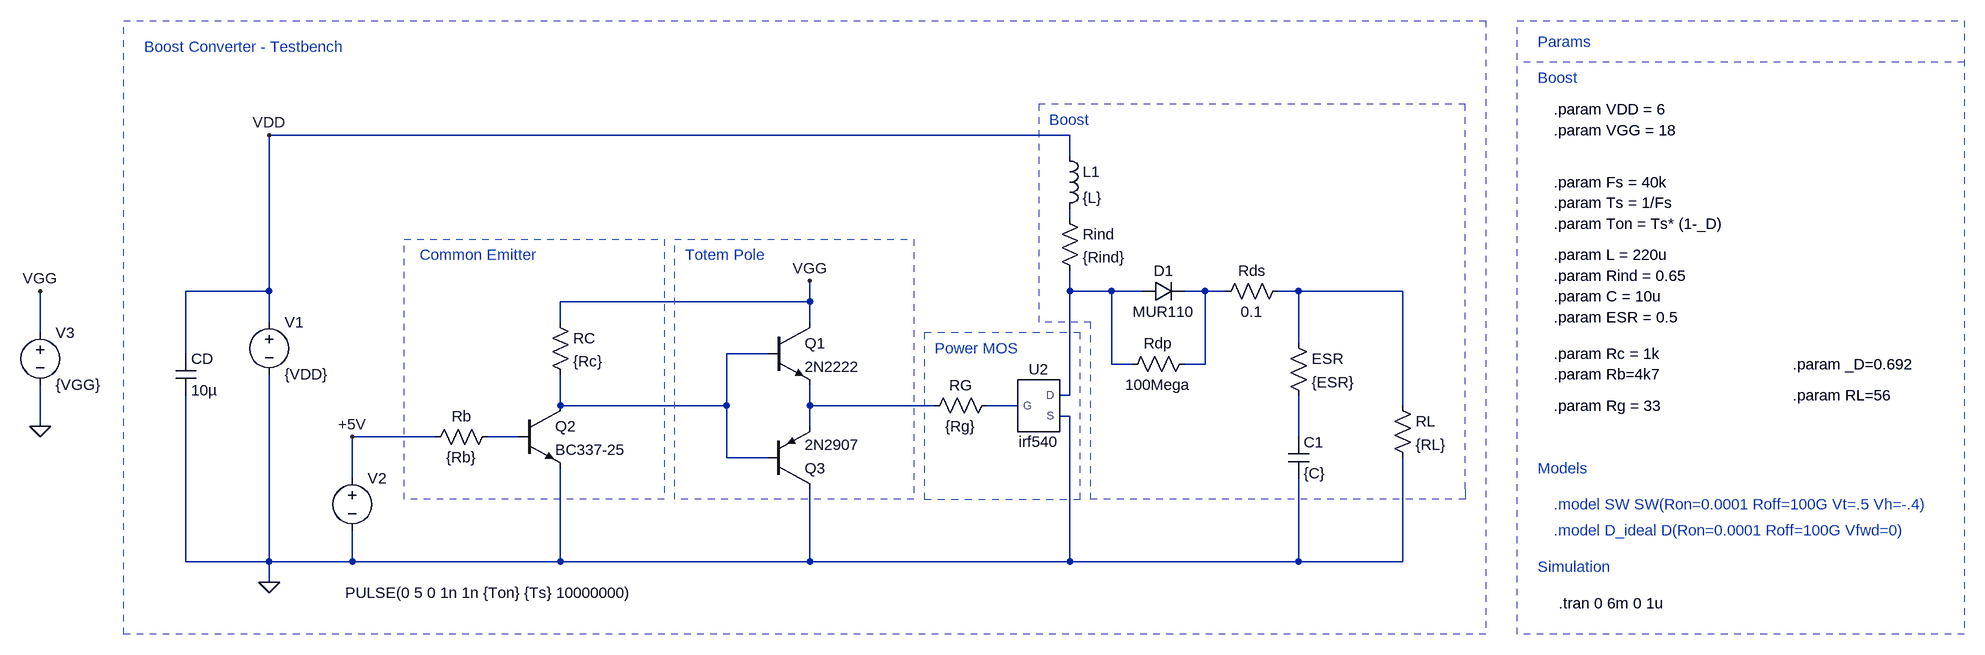
[diagram p0: schematic Boost_Completo.asc]
Boost_Completo.asc, the LTspice schematic file:
Version 4
SHEET 1 1252 680
WIRE -128 -224 -1360 -224
WIRE -128 -192 -128 -224
WIRE -128 -96 -128 -112
WIRE -1360 16 -1360 -224
WIRE -1360 16 -1488 16
WIRE -128 16 -128 -16
WIRE -64 16 -128 16
WIRE -16 16 -64 16
WIRE 80 16 48 16
WIRE 112 16 80 16
WIRE 224 16 192 16
WIRE 384 16 224 16
WIRE -528 32 -528 0
WIRE -528 32 -912 32
WIRE -1360 64 -1360 16
WIRE -912 64 -912 32
WIRE -528 64 -528 32
WIRE -1712 80 -1712 16
WIRE 224 96 224 16
WIRE -1488 112 -1488 16
WIRE -592 112 -656 112
WIRE -64 128 -64 16
WIRE -32 128 -64 128
WIRE 80 128 80 16
WIRE 80 128 48 128
WIRE -128 176 -128 16
WIRE -128 176 -144 176
WIRE -912 192 -912 144
WIRE -656 192 -656 112
WIRE -656 192 -912 192
WIRE -528 192 -528 160
WIRE -336 192 -528 192
WIRE -208 192 -256 192
WIRE 384 192 384 16
WIRE -128 208 -144 208
WIRE -1712 224 -1712 160
WIRE -528 224 -528 192
WIRE -1104 240 -1232 240
WIRE -976 240 -1024 240
WIRE 224 240 224 176
WIRE -656 272 -656 192
WIRE -592 272 -656 272
WIRE -1232 304 -1232 240
WIRE -1488 432 -1488 176
WIRE -1360 432 -1360 144
WIRE -1360 432 -1488 432
WIRE -1232 432 -1232 384
WIRE -1232 432 -1360 432
WIRE -912 432 -912 288
WIRE -912 432 -1232 432
WIRE -528 432 -528 320
WIRE -528 432 -912 432
WIRE -128 432 -128 208
WIRE -128 432 -528 432
WIRE 224 432 224 304
WIRE 224 432 -128 432
WIRE 384 432 384 272
WIRE 384 432 224 432
WIRE -1360 464 -1360 432
FLAG -1360 464 0
FLAG -1360 -224 VDD
FLAG -1232 240 +5V
FLAG -1712 224 0
FLAG -1712 16 VGG
FLAG -528 0 VGG
DATAFLAG 336 432 ""
DATAFLAG -704 192 ""
DATAFLAG -496 192 ""
SYMBOL diode -16 32 R270
WINDOW 0 32 32 VTop 2
WINDOW 3 0 32 VBottom 2
SYMATTR InstName D1
SYMATTR Value MUR110
SYMBOL res 368 176 R0
SYMATTR InstName RL
SYMATTR Value {RL}
SYMBOL cap 208 240 R0
SYMATTR InstName C1
SYMATTR Value {C}
SYMBOL ind -144 -208 R0
SYMATTR InstName L1
SYMATTR Value {L}
SYMBOL voltage -1232 288 R0
WINDOW 3 -11 192 Left 2
WINDOW 123 0 0 Left 0
WINDOW 39 0 0 Left 0
SYMATTR Value PULSE(0 5 0 1n 1n {Ton} {Ts} 10000000)
SYMATTR InstName V2
SYMBOL voltage -1360 48 R0
WINDOW 123 0 0 Left 0
WINDOW 39 0 0 Left 0
SYMATTR InstName V1
SYMATTR Value {VDD}
SYMBOL res -144 -112 R0
SYMATTR InstName Rind
SYMATTR Value {Rind}
SYMBOL res -240 176 R90
WINDOW 0 0 56 VBottom 2
WINDOW 3 32 56 VTop 2
SYMATTR InstName RG
SYMATTR Value {Rg}
SYMBOL npn -976 192 R0
SYMATTR InstName Q2
SYMATTR Value BC337-25
SYMBOL npn -592 64 R0
SYMATTR InstName Q1
SYMATTR Value 2N2222
SYMBOL pnp -592 320 M180
SYMATTR InstName Q3
SYMATTR Value 2N2907
SYMBOL res -1008 224 R90
WINDOW 0 0 56 VBottom 2
WINDOW 3 32 56 VTop 2
SYMATTR InstName Rb
SYMATTR Value {Rb}
SYMBOL res -928 48 R0
SYMATTR InstName RC
SYMATTR Value {Rc}
SYMBOL AutoGenerated\\irf540 -176 192 R0
SYMATTR InstName U2
SYMBOL cap -1504 112 R0
SYMATTR InstName CD
SYMATTR Value 10µ
SYMBOL res 208 80 R0
SYMATTR InstName ESR
SYMATTR Value {ESR}
SYMBOL res 208 0 R90
WINDOW 0 0 56 VBottom 2
WINDOW 3 32 56 VTop 2
SYMATTR InstName Rds
SYMATTR Value 0.1
SYMBOL res 64 112 R90
WINDOW 0 0 56 VBottom 2
WINDOW 3 32 56 VTop 2
SYMATTR InstName Rdp
SYMATTR Value 100Mega
SYMBOL voltage -1712 64 R0
WINDOW 123 0 0 Left 0
WINDOW 39 0 0 Left 0
SYMATTR InstName V3
SYMATTR Value {VGG}
TEXT 616 -40 Left 2 !.param L = 220u
TEXT 616 24 Left 2 !.param C = 10u
TEXT 624 496 Left 2 !.tran 0 6m 0 1u
TEXT 616 -264 Left 2 !.param VDD = 6
TEXT 984 128 Left 2 !.param _D=0.692
TEXT 616 -152 Left 2 !.param Fs = 40k
TEXT 616 -120 Left 2 !.param Ts = 1/Fs
TEXT 616 -88 Left 2 !.param Ton = Ts* (1-_D)
TEXT 616 344 Left 2 ;.model SW SW(Ron=0.0001 Roff=100G Vt=.5 Vh=-.4)
TEXT 616 384 Left 2 ;.model D_ideal D(Ron=0.0001 Roff=100G Vfwd=0)
TEXT 592 -368 Left 2 ;Params
TEXT 592 -312 Left 2 ;Boost
TEXT 616 -232 Left 2 !.param VGG = 18
TEXT 616 112 Left 2 !.param Rc = 1k
TEXT 616 144 Left 2 !.param Rb=4k7
TEXT 616 192 Left 2 !.param Rg = 33
TEXT 592 288 Left 2 ;Models
TEXT 592 440 Left 2 ;Simulation
TEXT -336 104 Left 2 ;Power MOS
TEXT -160 -248 Left 2 ;Boost
TEXT -720 -40 Left 2 ;Totem Pole
TEXT -1128 -40 Left 2 ;Common Emitter
TEXT 616 -8 Left 2 !.param Rind = 0.65
TEXT -1552 -360 Left 2 ;Boost Converter - Testbench
TEXT 984 176 Left 2 !.param RL=56
TEXT 616 56 Left 2 !.param ESR = 0.5
LINE Normal -176 -272 -176 64 2
LINE Normal 480 -272 -176 -272 2
LINE Normal 480 320 480 -272 2
LINE Normal 1248 -336 560 -336 2
LINE Normal -112 80 -352 80 2
LINE Normal -112 336 -112 80 2
LINE Normal -352 336 -112 336 2
LINE Normal -352 80 -352 336 2
LINE Normal -96 64 -176 64 2
LINE Normal -96 336 -96 64 2
LINE Normal 480 336 -96 336 2
LINE Normal 480 320 480 336 2
RECTANGLE Normal -368 336 -736 -64 2
RECTANGLE Normal -752 336 -1152 -64 2
RECTANGLE Normal 1248 544 560 -400 2
RECTANGLE Normal -1584 -400 512 544 2

The netlist it stands for:
* Boost_Completo.asc
D1 N002 N003 MUR110
RL N004 0 {RL}
C1 N009 0 {C}
L1 VDD N001 {L}
V2 +5V 0 PULSE(0 5 0 1n 1n {Ton} {Ts} 10000000)
V1 VDD 0 {VDD}
Rind N001 N002 {Rind}
RG N007 N006 {Rg}
Q2 N005 N008 0 0 BC337-25
Q1 VGG N005 N006 0 2N2222
Q3 0 N005 N006 0 2N2907
Rb N008 +5V {Rb}
RC VGG N005 {Rc}
XU2 N002 N007 0 irf540  ; pins D G S
CD VDD 0 10µ
R§ESR N004 N009 {ESR}
Rds N004 N003 0.1
Rdp N003 N002 100Mega
V3 VGG 0 {VGG}
.model D D
.lib standard.dio
.model NPN NPN
.model PNP PNP
.lib standard.bjt
.param L = 220u
.param C = 10u
.tran 0 6m 0 1u
.param VDD = 6
.param _D=0.692
.param Fs = 40k
.param Ts = 1/Fs
.param Ton = Ts* (1-_D)
* .model SW SW(Ron=0.0001 Roff=100G Vt=.5 Vh=-.4)
* .model D_ideal D(Ron=0.0001 Roff=100G Vfwd=0)
* Params
* Boost
.param VGG = 18
.param Rc = 1k
.param Rb=4k7
.param Rg = 33
* Models
* Simulation
* Power MOS
* Boost
* Totem Pole
* Common Emitter
.param Rind = 0.65
* Boost Converter - Testbench
.param RL=56
.param ESR = 0.5
.lib D:\Documentos\Lib LT\Importados-lib\irf540.lib
.backanno
.end